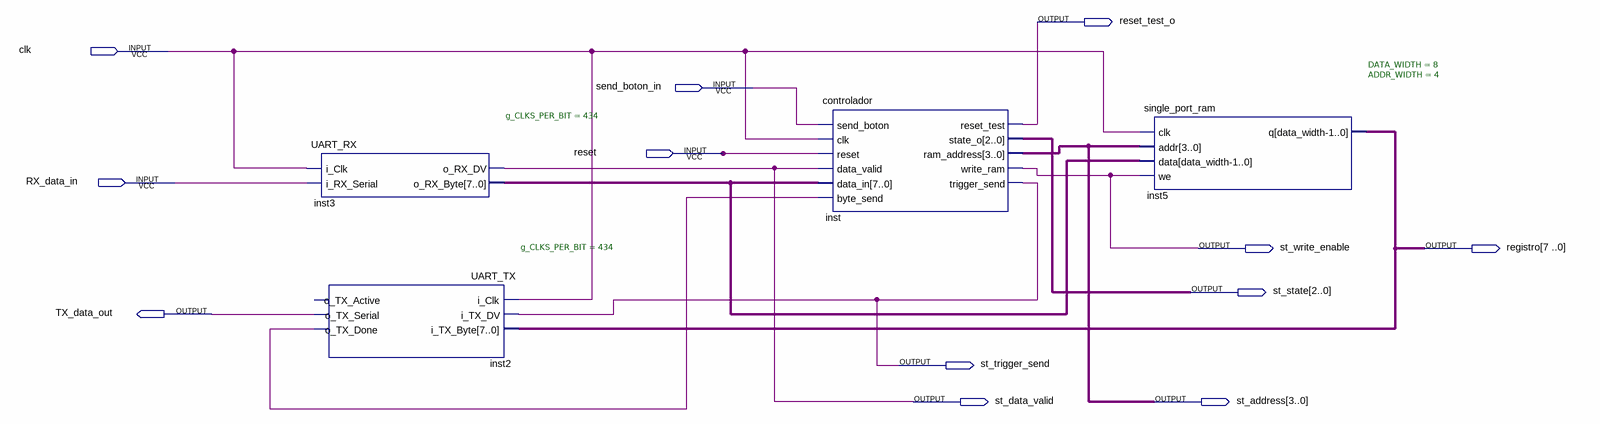
[diagram p0: schematic sheet]
// Quartus schematic controlador_main.bdf as structural Verilog: 4 symbols, 12 pins
module controlador_main (
  input  clk,
  input  send_boton_in,
  input  reset,
  input  RX_data_in,
  output reset_test_o,
  output st_write_enable,
  output [7:0] registro,
  output [2:0] st_state,
  output TX_data_out,
  output st_trigger_send,
  output st_data_valid,
  output [3:0] st_address
);

  wire inst2_o_tx_done;
  wire [7:0] inst3_o_rx_byte;

  UART_RX #(.g_CLKS_PER_BIT(434)) inst3 (
    .i_Clk(clk), .i_RX_Serial(RX_data_in), .o_RX_DV(st_data_valid), .o_RX_Byte(inst3_o_rx_byte));
  UART_TX #(.g_CLKS_PER_BIT(434)) inst2 (
    .i_Clk(clk), .i_TX_DV(st_trigger_send), .i_TX_Byte(registro), .o_TX_Serial(TX_data_out),
    .o_TX_Done(inst2_o_tx_done));  // open: o_TX_Active
  controlador inst (
    .send_boton(send_boton_in), .clk(clk), .reset(reset), .data_valid(st_data_valid),
    .data_in(inst3_o_rx_byte), .byte_send(inst2_o_tx_done), .reset_test(reset_test_o), .state_o(st_state),
    .ram_address(st_address), .write_ram(st_write_enable), .trigger_send(st_trigger_send));
  single_port_ram #(.DATA_WIDTH(8), .ADDR_WIDTH(4)) inst5 (
    .clk(clk), .addr(st_address), .data(inst3_o_rx_byte), .we(st_write_enable), .q(registro));
endmodule
